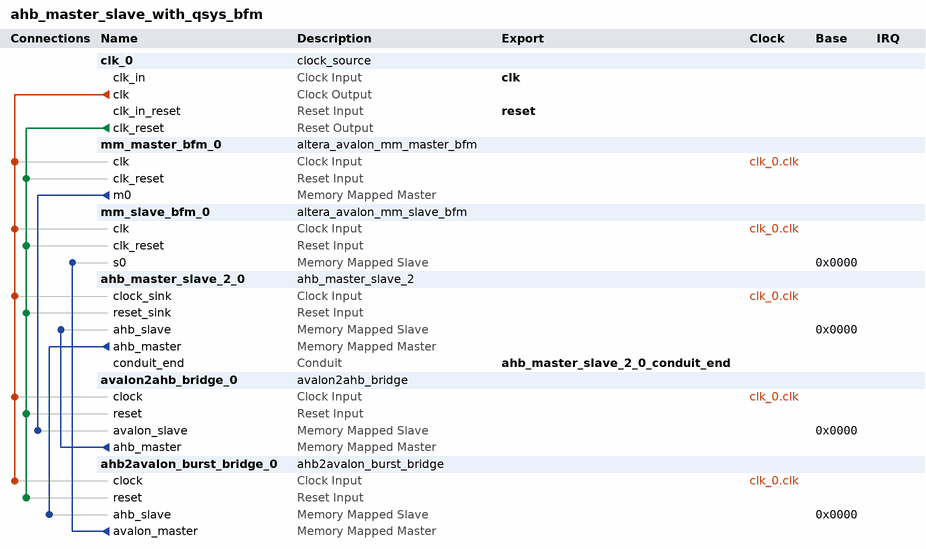
[diagram p0: system contents]
# Platform Designer (Qsys) system ahb_master_slave_with_qsys_bfm, Cyclone IV GX Unknown
# Parameters at their usual value, and those the tool derives, are not listed.
package require -exact qsys 14.0
create_system ahb_master_slave_with_qsys_bfm
set_project_property DEVICE_FAMILY {Cyclone IV GX}
set_project_property DEVICE Unknown

add_instance clk_0 clock_source 14.0
set_instance_parameter_value clk_0 clockFrequency 50000000

add_instance mm_master_bfm_0 altera_avalon_mm_master_bfm 14.0
set_instance_parameter_value mm_master_bfm_0 AV_ADDRESS_W 32
set_instance_parameter_value mm_master_bfm_0 AV_NUMSYMBOLS 4
set_instance_parameter_value mm_master_bfm_0 AV_BURSTCOUNT_W 3
set_instance_parameter_value mm_master_bfm_0 AV_READRESPONSE_W 8
set_instance_parameter_value mm_master_bfm_0 AV_WRITERESPONSE_W 8
set_instance_parameter_value mm_master_bfm_0 USE_READ 1
set_instance_parameter_value mm_master_bfm_0 USE_BYTE_ENABLE 1
set_instance_parameter_value mm_master_bfm_0 USE_BURSTCOUNT 1
set_instance_parameter_value mm_master_bfm_0 USE_READ_DATA 1
set_instance_parameter_value mm_master_bfm_0 USE_READ_DATA_VALID 1
set_instance_parameter_value mm_master_bfm_0 USE_WAIT_REQUEST 1
set_instance_parameter_value mm_master_bfm_0 AV_CONSTANT_BURST_BEHAVIOR 1
set_instance_parameter_value mm_master_bfm_0 AV_BURST_LINEWRAP 1
set_instance_parameter_value mm_master_bfm_0 AV_BURST_BNDR_ONLY 1
set_instance_parameter_value mm_master_bfm_0 AV_ALWAYS_BURST_MAX_BURST 0
set_instance_parameter_value mm_master_bfm_0 AV_MAX_PENDING_WRITES 0
set_instance_parameter_value mm_master_bfm_0 AV_FIX_READ_LATENCY 1
set_instance_parameter_value mm_master_bfm_0 AV_READ_WAIT_TIME 1
set_instance_parameter_value mm_master_bfm_0 ADDRESS_UNITS SYMBOLS
set_instance_parameter_value mm_master_bfm_0 VHDL_ID 0

add_instance mm_slave_bfm_0 altera_avalon_mm_slave_bfm 14.0
set_instance_parameter_value mm_slave_bfm_0 AV_ADDRESS_W 5
set_instance_parameter_value mm_slave_bfm_0 AV_SYMBOL_W 8
set_instance_parameter_value mm_slave_bfm_0 AV_NUMSYMBOLS 4
set_instance_parameter_value mm_slave_bfm_0 AV_BURSTCOUNT_W 4
set_instance_parameter_value mm_slave_bfm_0 AV_READRESPONSE_W 8
set_instance_parameter_value mm_slave_bfm_0 AV_WRITERESPONSE_W 8
set_instance_parameter_value mm_slave_bfm_0 USE_READ 1
set_instance_parameter_value mm_slave_bfm_0 USE_WRITE 1
set_instance_parameter_value mm_slave_bfm_0 USE_ADDRESS 1
set_instance_parameter_value mm_slave_bfm_0 USE_BYTE_ENABLE 1
set_instance_parameter_value mm_slave_bfm_0 USE_BURSTCOUNT 0
set_instance_parameter_value mm_slave_bfm_0 USE_READ_DATA 1
set_instance_parameter_value mm_slave_bfm_0 USE_READ_DATA_VALID 1
set_instance_parameter_value mm_slave_bfm_0 USE_WRITE_DATA 1
set_instance_parameter_value mm_slave_bfm_0 USE_BEGIN_TRANSFER 0
set_instance_parameter_value mm_slave_bfm_0 USE_BEGIN_BURST_TRANSFER 0
set_instance_parameter_value mm_slave_bfm_0 USE_ARBITERLOCK 0
set_instance_parameter_value mm_slave_bfm_0 USE_LOCK 0
set_instance_parameter_value mm_slave_bfm_0 USE_DEBUGACCESS 0
set_instance_parameter_value mm_slave_bfm_0 USE_WAIT_REQUEST 1
set_instance_parameter_value mm_slave_bfm_0 USE_TRANSACTIONID 0
set_instance_parameter_value mm_slave_bfm_0 USE_WRITERESPONSE 0
set_instance_parameter_value mm_slave_bfm_0 USE_READRESPONSE 0
set_instance_parameter_value mm_slave_bfm_0 USE_CLKEN 0
set_instance_parameter_value mm_slave_bfm_0 ASSERT_HIGH_RESET 1
set_instance_parameter_value mm_slave_bfm_0 ASSERT_HIGH_WAITREQUEST 1
set_instance_parameter_value mm_slave_bfm_0 ASSERT_HIGH_READ 1
set_instance_parameter_value mm_slave_bfm_0 ASSERT_HIGH_WRITE 1
set_instance_parameter_value mm_slave_bfm_0 ASSERT_HIGH_BYTEENABLE 1
set_instance_parameter_value mm_slave_bfm_0 ASSERT_HIGH_READDATAVALID 1
set_instance_parameter_value mm_slave_bfm_0 ASSERT_HIGH_ARBITERLOCK 1
set_instance_parameter_value mm_slave_bfm_0 ASSERT_HIGH_LOCK 1
set_instance_parameter_value mm_slave_bfm_0 AV_BURST_LINEWRAP 0
set_instance_parameter_value mm_slave_bfm_0 AV_BURST_BNDR_ONLY 0
set_instance_parameter_value mm_slave_bfm_0 AV_MAX_PENDING_READS 32
set_instance_parameter_value mm_slave_bfm_0 AV_MAX_PENDING_WRITES 0
set_instance_parameter_value mm_slave_bfm_0 AV_FIX_READ_LATENCY 0
set_instance_parameter_value mm_slave_bfm_0 AV_READ_WAIT_TIME 1
set_instance_parameter_value mm_slave_bfm_0 AV_WRITE_WAIT_TIME 0
set_instance_parameter_value mm_slave_bfm_0 REGISTER_WAITREQUEST 0
set_instance_parameter_value mm_slave_bfm_0 AV_REGISTERINCOMINGSIGNALS 0
set_instance_parameter_value mm_slave_bfm_0 ADDRESS_UNITS WORDS
set_instance_parameter_value mm_slave_bfm_0 VHDL_ID 0

add_instance ahb_master_slave_2_0 ahb_master_slave_2 2.0

add_instance avalon2ahb_bridge_0 avalon2ahb_bridge 2.0
set_instance_parameter_value avalon2ahb_bridge_0 AVALON_ADDRESSWIDTH 5
set_instance_parameter_value avalon2ahb_bridge_0 ADDRESSWIDTH 32
set_instance_parameter_value avalon2ahb_bridge_0 DATAWIDTH 32

add_instance ahb2avalon_burst_bridge_0 ahb2avalon_burst_bridge 1.0
set_instance_parameter_value ahb2avalon_burst_bridge_0 ADDRESSWIDTH 32
set_instance_parameter_value ahb2avalon_burst_bridge_0 DATAWIDTH 32
set_instance_parameter_value ahb2avalon_burst_bridge_0 FIFODEPTH 32
set_instance_parameter_value ahb2avalon_burst_bridge_0 FIFODEPTH_LOG 5
set_instance_parameter_value ahb2avalon_burst_bridge_0 MAXBURSTCOUNT 8

# connections
add_connection clk_0.clk ahb2avalon_burst_bridge_0.clock clock
add_connection clk_0.clk ahb_master_slave_2_0.clock_sink clock
add_connection clk_0.clk avalon2ahb_bridge_0.clock clock
add_connection clk_0.clk mm_master_bfm_0.clk clock
add_connection clk_0.clk mm_slave_bfm_0.clk clock
add_connection clk_0.clk_reset ahb2avalon_burst_bridge_0.reset reset
add_connection clk_0.clk_reset ahb_master_slave_2_0.reset_sink reset
add_connection clk_0.clk_reset avalon2ahb_bridge_0.reset reset
add_connection clk_0.clk_reset mm_master_bfm_0.clk_reset reset
add_connection clk_0.clk_reset mm_slave_bfm_0.clk_reset reset
add_connection ahb2avalon_burst_bridge_0.avalon_master mm_slave_bfm_0.s0 avalon
set_connection_parameter_value ahb2avalon_burst_bridge_0.avalon_master/mm_slave_bfm_0.s0 baseAddress 0x0000
add_connection ahb_master_slave_2_0.ahb_master ahb2avalon_burst_bridge_0.ahb_slave avalon
set_connection_parameter_value ahb_master_slave_2_0.ahb_master/ahb2avalon_burst_bridge_0.ahb_slave baseAddress 0x0000
add_connection avalon2ahb_bridge_0.ahb_master ahb_master_slave_2_0.ahb_slave avalon
set_connection_parameter_value avalon2ahb_bridge_0.ahb_master/ahb_master_slave_2_0.ahb_slave baseAddress 0x0000
add_connection mm_master_bfm_0.m0 avalon2ahb_bridge_0.avalon_slave avalon
set_connection_parameter_value mm_master_bfm_0.m0/avalon2ahb_bridge_0.avalon_slave baseAddress 0x0000

# exported interfaces
add_interface clk clock sink
set_interface_property clk EXPORT_OF clk_0.clk_in
add_interface reset reset sink
set_interface_property reset EXPORT_OF clk_0.clk_in_reset
add_interface ahb_master_slave_2_0_conduit_end conduit end
set_interface_property ahb_master_slave_2_0_conduit_end EXPORT_OF ahb_master_slave_2_0.conduit_end

set_interconnect_requirement {$system} qsys_mm.clockCrossingAdapter HANDSHAKE
set_interconnect_requirement {$system} qsys_mm.maxAdditionalLatency 1
set_interconnect_requirement {$system} qsys_mm.insertDefaultSlave FALSE

save_system ahb_master_slave_with_qsys_bfm.qsys
